# EAGLE design m202-stereo-input (EAGLE 7.6.0)
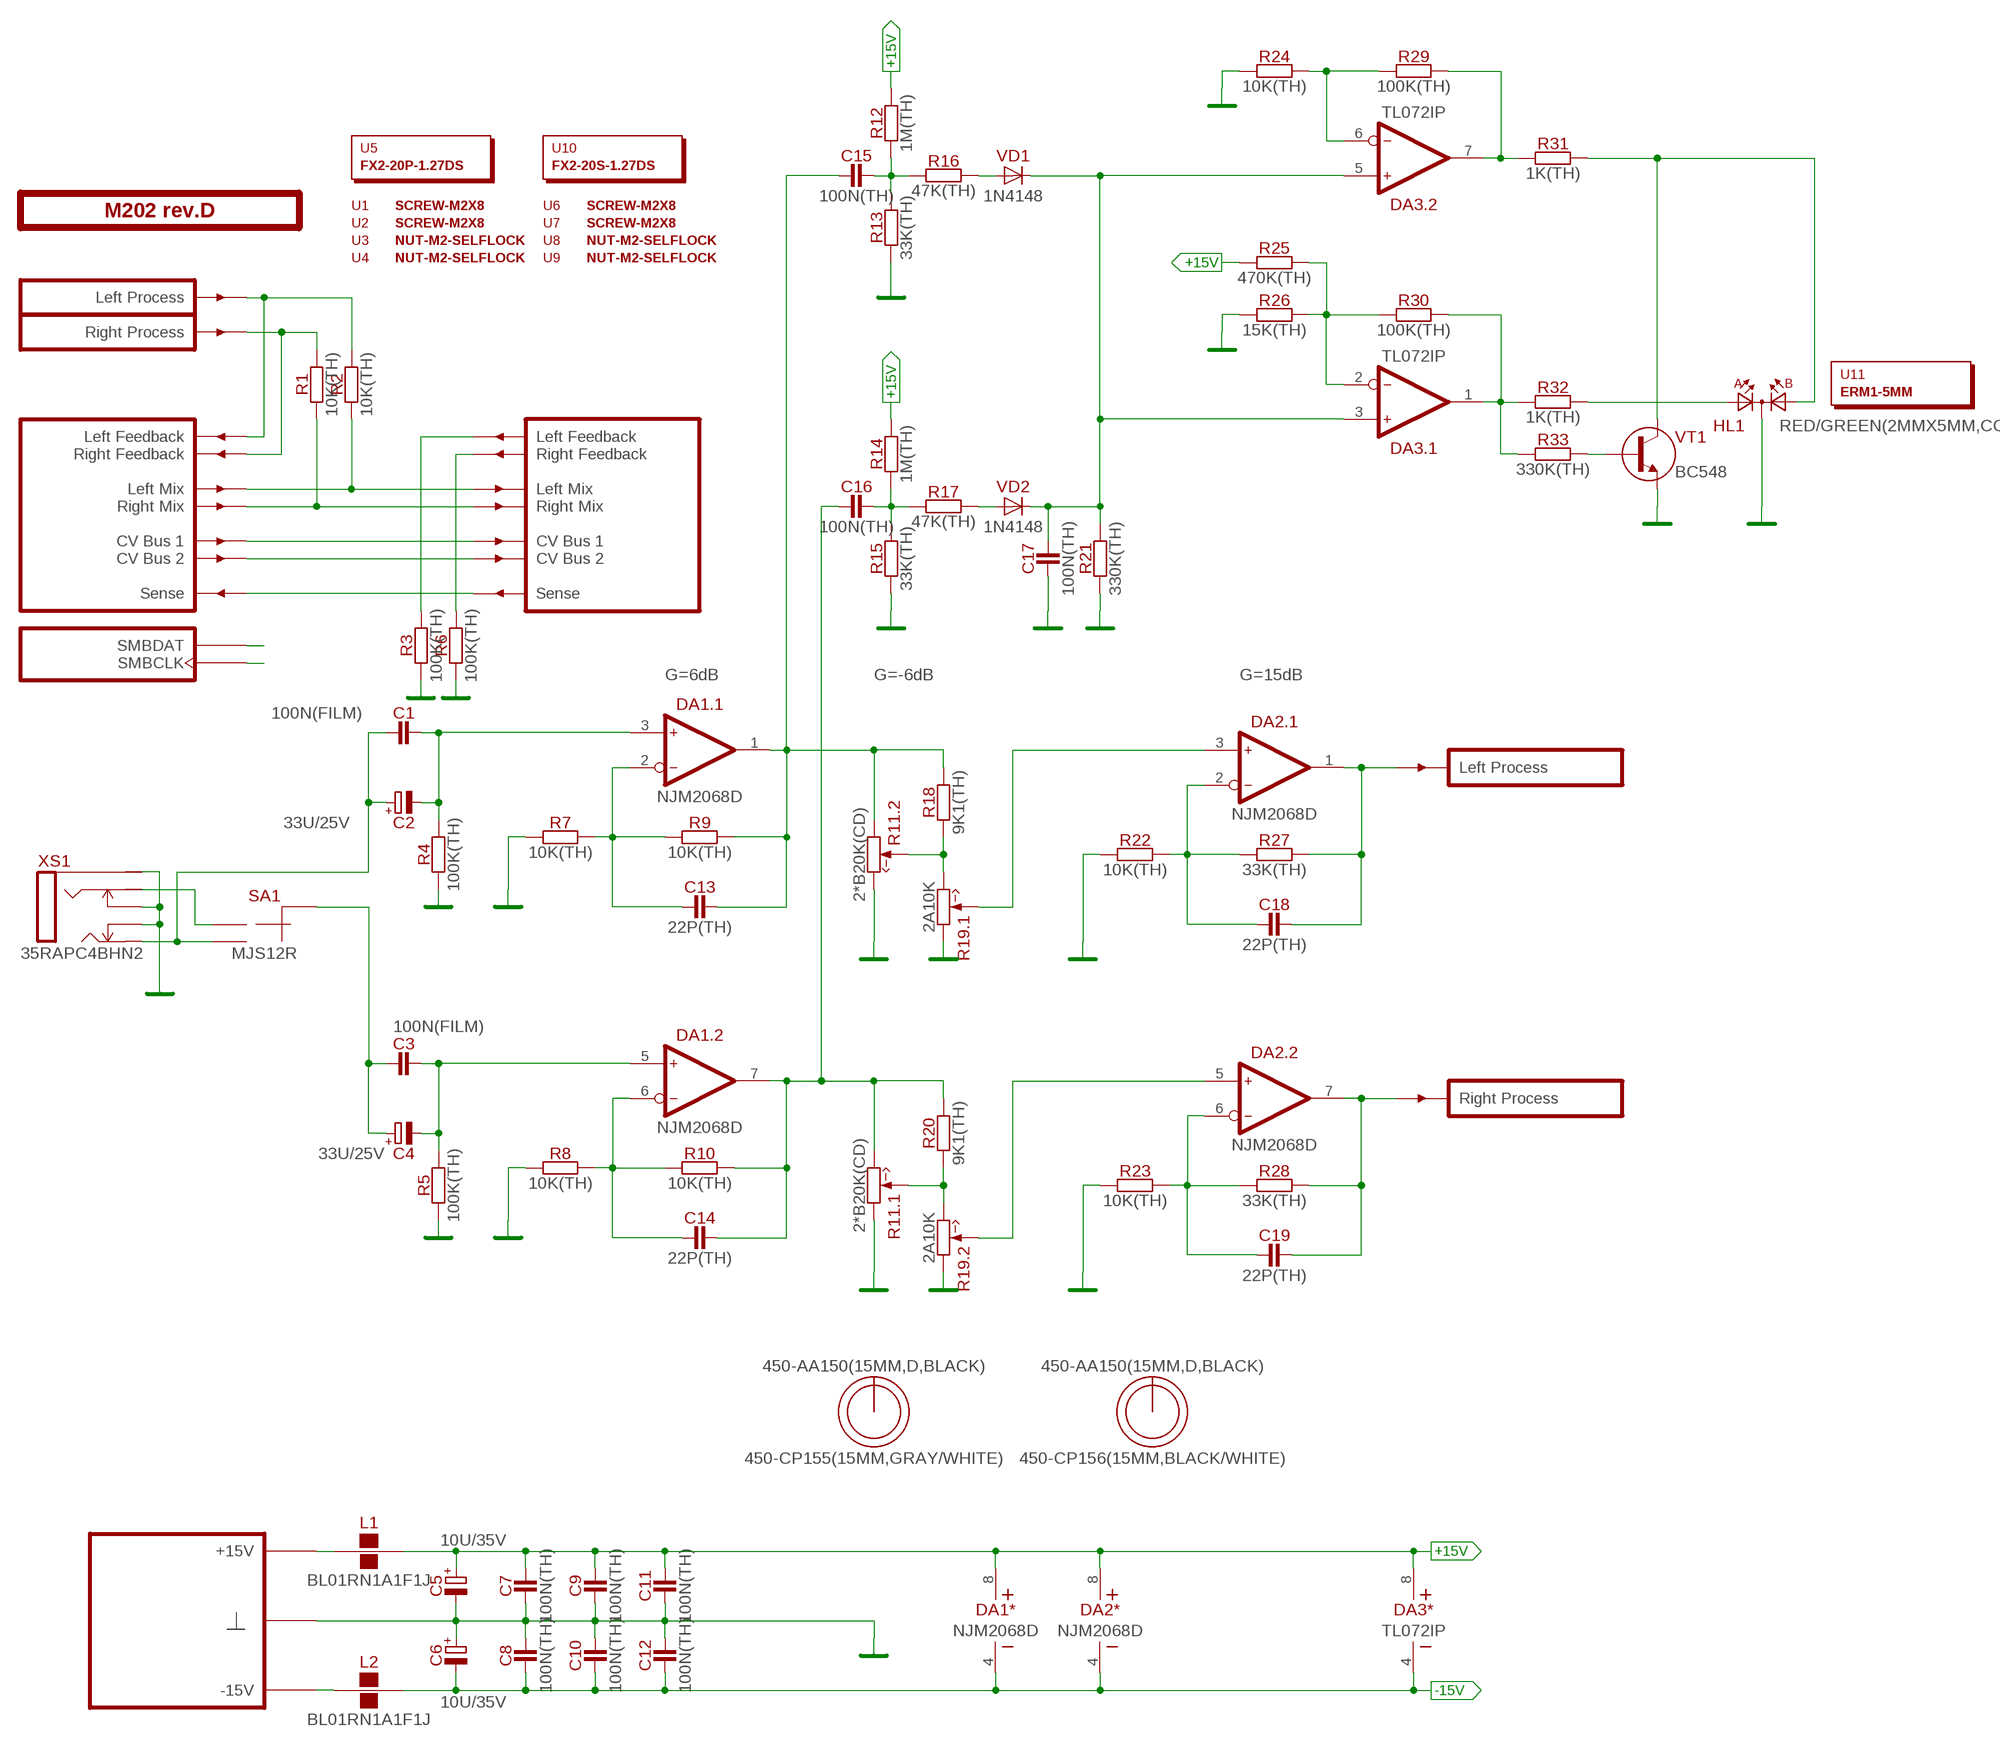
[diagram p0: schematic, sheet 1]

## Parts
C1  100N(FILM)  [C050-025X075]
C2  33U/25V  [E2,5-7]
C3  100N(FILM)  [C050-025X075]
C4  33U/25V  [E2,5-7]
C5  10U/35V  [E2-5]
C6  10U/35V  [E2-5]
C7  100N(TH)  [C050-024X044]
C8  100N(TH)  [C050-024X044]
C9  100N(TH)  [C050-024X044]
C10  100N(TH)  [C050-024X044]
C11  100N(TH)  [C050-024X044]
C12  100N(TH)  [C050-024X044]
C13  22P(TH)  [C050-024X044]
C14  22P(TH)  [C050-024X044]
C15  100N(TH)  [C050-024X044]
C16  100N(TH)  [C050-024X044]
C17  100N(TH)  [C050-024X044]
C18  22P(TH)  [C050-024X044]
C19  22P(TH)  [C050-024X044]
DA1  NJM2068D  [DIP-8]
DA2  NJM2068D  [DIP-8]
DA3  TL072IP  [DIP-8]
HL1  RED/GREEN(2MMX5MM,CC)  [LED2X5-3PIN]
L1  BL01RN1A1F1J  [BL01RN1A]
L2  BL01RN1A1F1J  [BL01RN1A]
O1  450-AA150(15MM,D,BLACK)  [EMPTY]
O2  450-CP155(15MM,GRAY/WHITE)  [EMPTY]
O3  450-AA150(15MM,D,BLACK)  [EMPTY]
O4  450-CP156(15MM,BLACK/WHITE)  [EMPTY]
PCB1  M202 rev.D  ST2-BOARD-50  [ST2-BOARD-50]
R1  10K(TH)  [R-0207/10]
R2  10K(TH)  [R-0207/10]
R3  100K(TH)  [R-0207/10]
R4  100K(TH)  [R-0207/10]
R5  100K(TH)  [R-0207/10]
R6  100K(TH)  [R-0207/10]
R7  10K(TH)  [R-0207/10]
R8  10K(TH)  [R-0207/10]
R9  10K(TH)  [R-0207/10]
R10  10K(TH)  [R-0207/10]
R11  2*B20K(CD)  2B20K(CD)  [RV11-DUAL]
R12  1M(TH)  [R-0207/10]
R13  33K(TH)  [R-0207/10]
R14  1M(TH)  [R-0207/10]
R15  33K(TH)  [R-0207/10]
R16  47K(TH)  [R-0207/10]
R17  47K(TH)  [R-0207/10]
R18  9K1(TH)  [R-0207/10]
R19  2A10K  [RV11-DUAL]
R20  9K1(TH)  [R-0207/10]
R21  330K(TH)  [R-0207/10]
R22  10K(TH)  [R-0207/10]
R23  10K(TH)  [R-0207/10]
R24  10K(TH)  [R-0207/10]
R25  470K(TH)  [R-0207/10]
R26  15K(TH)  [R-0207/10]
R27  33K(TH)  [R-0207/10]
R28  33K(TH)  [R-0207/10]
R29  100K(TH)  [R-0207/10]
R30  100K(TH)  [R-0207/10]
R31  1K(TH)  [R-0207/10]
R32  1K(TH)  [R-0207/10]
R33  330K(TH)  [R-0207/10]
SA1  MJS12R  [APEM-MJS12R]
U1  SCREW-M2X8  [EMPTY]
U2  SCREW-M2X8  [EMPTY]
U3  NUT-M2-SELFLOCK  [EMPTY]
U4  NUT-M2-SELFLOCK  [EMPTY]
U5  FX2-20P-1.27DS  [EMPTY]
U6  SCREW-M2X8  [EMPTY]
U7  SCREW-M2X8  [EMPTY]
U8  NUT-M2-SELFLOCK  [EMPTY]
U9  NUT-M2-SELFLOCK  [EMPTY]
U10  FX2-20S-1.27DS  [EMPTY]
U11  ERM1-5MM  [EMPTY]
VD1  1N4148  [DO35-7]
VD2  1N4148  [DO35-7]
VT1  BC548  [TO92]
XS1  35RAPC4BHN2  [35RAP]

## Nets
+15V [power]: C5.+ C7.2 C9.2 C11.2 DA1.8(*:V+) DA2.8(*:V+) DA3.8(*:V+) L1.2 R12.2 R14.2 R25.1
-15V: C6.- C8.1 C10.1 C12.1 DA1.4(*:V-) DA2.4(*:V-) DA3.4(*:V-) L2.2
GND: C5.- C6.+ C7.1 C8.2 C9.1 C10.2 C11.1 C12.2 C17.1 HL1.K PCB1.B4'(GND) PCB1.B4(GND) PCB1.B5'(GND) PCB1.B5(GND) PCB1.B6'(GND) PCB1.B6(GND) PCB1.B7'(GND) PCB1.B7(GND) PCB1.B8'(GND) PCB1.B8(GND) R3.1 R4.1 R5.1 R6.1 R7.1 R8.1 R11.1(.1:CCW) R11.3'(.2:CW) R13.1 R15.1 R19.1'(.2:CCW) R19.1(.1:CCW) R21.1 R22.1 R23.1 R24.1 R26.1 VT1.3(E) XS1.1(S) XS1.10(TN) XS1.11(RN)
LMIX: PCB1.ALMIX'(LMIX') PCB1.ALMIX(LMIX) R2.1
N$1: L1.1 PCB1.A+15'(P+15V) PCB1.A+15(P+15V) PCB1.B+15'(P+15V) PCB1.B+15(P+15V)
N$2: PCB1.ARFBK'(RFBK') R6.2
N$3: DA2.3(.1:IN+) R19.2(.1:W)
N$4: PCB1.ALFBK'(LFBK') R3.2
N$5: L2.1 PCB1.A-15'(P-15V) PCB1.A-15(P-15V) PCB1.B-15'(P-15V) PCB1.B-15(P-15V)
N$6: SA1.NC XS1.3(R)
N$7: C1.1 C2.+ SA1.NO XS1.2(T)
N$8: DA2.5(.2:IN+) R19.2'(.2:W)
N$9: C3.2 C4.- DA1.5(.2:IN+) R5.2
N$10: C1.2 C2.- DA1.3(.1:IN+) R4.2
N$11: C19.2 DA2.7(.2:OUT) PCB1.BOUTR'(OUTR) R28.2
N$12: C18.2 DA2.1(.1:OUT) PCB1.BOUTL'(OUTL) R27.2
N$13: C18.1 DA2.2(.1:IN-) R22.2 R27.1
N$14: C19.1 DA2.6(.2:IN-) R23.2 R28.1
N$15: C14.2 C16.1 DA1.7(.2:OUT) R10.2 R11.3(.1:CW) R20.2
N$16: PCB1.BSENSE'(SENSE') PCB1.BSENSE(SENSE)
N$17: C15.2 R12.1 R13.2 R16.1
N$18: DA3.6(.2:IN-) R24.2 R29.1
N$19: C13.2 C15.1 DA1.1(.1:OUT) R9.2 R11.1'(.2:CCW) R18.2
N$20: DA3.7(.2:OUT) R29.2 R31.1
N$21: HL1.A2 R31.2 VT1.1(C)
N$22: DA3.2(.1:IN-) R25.2 R26.2 R30.1
N$23: DA3.1(.1:OUT) R30.2 R32.1 R33.1
N$25: R33.2 VT1.2(B)
N$26: C13.1 DA1.2(.1:IN-) R7.2 R9.1
N$27: C14.1 DA1.6(.2:IN-) R8.2 R10.1
N$29: R16.2 VD1.A
N$30: R11.2'(.2:W) R18.1 R19.3(.1:CW)
N$31: C16.2 R14.1 R15.2 R17.1
N$32: R11.2(.1:W) R19.3'(.2:CW) R20.1
N$33: HL1.A1 R32.2
N$36: C3.1 C4.+ SA1.C(CM)
N$38: PCB1.ASMBDAT'(SMBDAT) PCB1.ASMBDAT(SMBDAT)
N$39: PCB1.ARFBK(RFBK) PCB1.BINR(INR) R1.2
N$40: PCB1.ALFBK(LFBK) PCB1.BINL(INL) R2.2
N$41: PCB1.ACV1'(CV1') PCB1.ACV1(CV1)
N$42: PCB1.ACV2'(CV2') PCB1.ACV2(CV2)
N$43: PCB1.ASMBCLK'(SMBCLK) PCB1.ASMBCLK(SMBCLK)
N$44: R17.2 VD2.A
N$45: C17.2 DA3.3(.1:IN+) DA3.5(.2:IN+) R21.2 VD1.C VD2.C
RMIX: PCB1.ARMIX'(RMIX') PCB1.ARMIX(RMIX) R1.1

## Notes on the sheet
- G=6dB | G=-6dB | G=15dB

## Library data of the parts
C1 C3 = capacitors:?; MOUSER: 505-MKS2.1/63/5
C2 C4 = capacitors-electrolytic:?
C5 C6 = capacitors-electrolytic:?; MOUSER: 647-USW1V100MDD
C7-C12 C15-C17 = capacitors:?; MOUSER: 81-RCER71H104K0A2H3B
C13 C14 C18 C19 = capacitors:?
DA1 DA2 = ic-jrc:NJM2068; MOUSER: 513-NJM2068D
DA3 = ic-ti:TL072; MOUSER: 595-TL072IP
HL1 = optoelectronics:?(2MMX5MM,CC)
L1 L2 = inductors:BL01RN1A?; MOUSER: 81-BL01RN1A1F1J
O1 O3 = hardware:450-AA?; MOUSER: 450-AA150
O2 = hardware:450-C?; MOUSER: 450-CP155
O4 = hardware:450-C?; MOUSER: 450-CP156
PCB1 = module-footprints:ST2-BOARD-?
R1 R2 R7-R10 R22-R24 = resistors:?; MOUSER: 71-RN55D-F-10K
R3-R6 R29 R30 = resistors:?; MOUSER: 71-RN55D-F-100K
R11 = potentiometers:2**?; MOUSER: 688-RK12L1230C1M
R12-R18 R20 R21 R25-R28 R33 = resistors:?
R19 = potentiometers:2**?; MOUSER: 688-RK12L12C0A0E
R31 R32 = resistors:?; MOUSER: 71-RN55D-F-1.0K
SA1 = switches:MJS12R; MOUSER: 642-MJS12R
U1-U4 U6-U9 = hardware:*?
U5 = hardware:?; MOUSER: 798-FX2-20P-1.27DS71
U10 = hardware:?; MOUSER: 798-FX2-20S-1.27DS71
U11 = hardware:?
VD1 VD2 = diodes:?; MOUSER: 583-1N4148-T
VT1 = transistors-npn:?
XS1 = connectors:35RAPC4BHN2; MOUSER: 502-35RAPC4BHN2

## Board
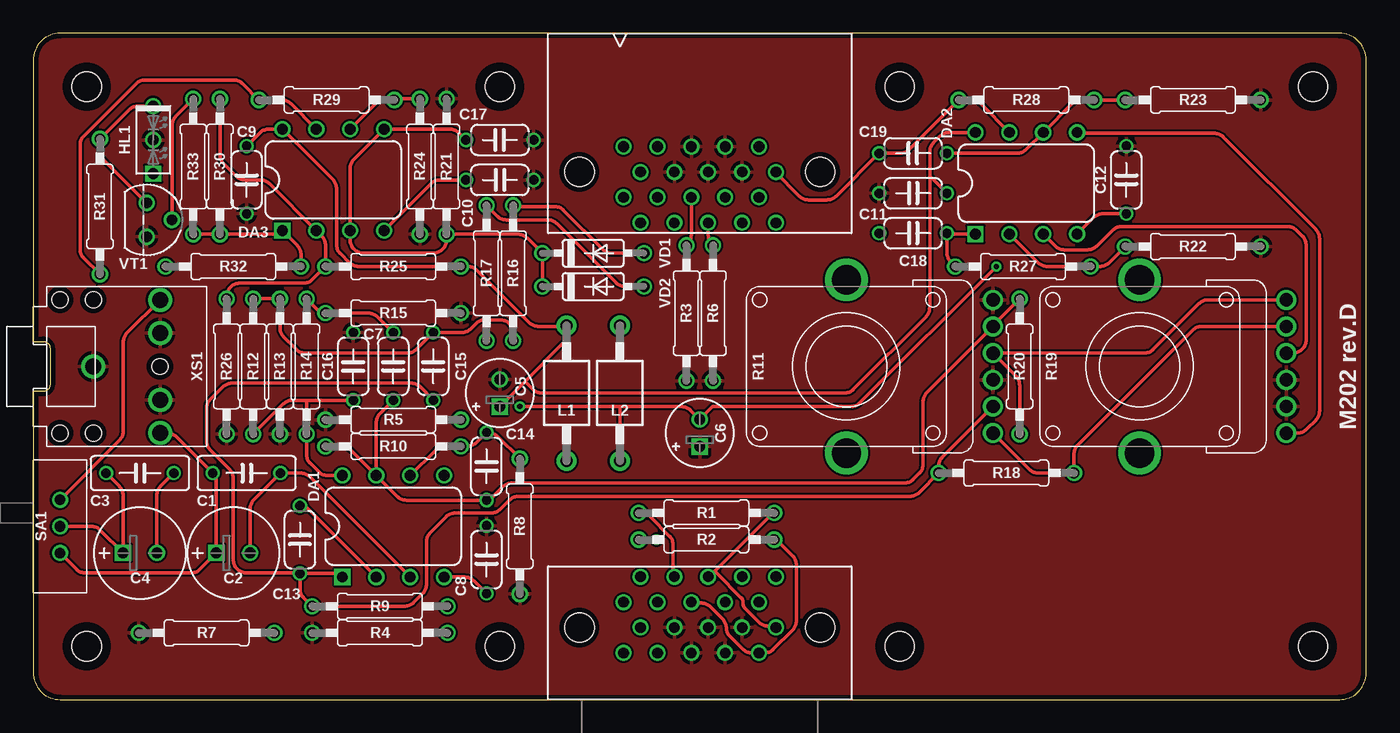
[diagram p1: board, top side]
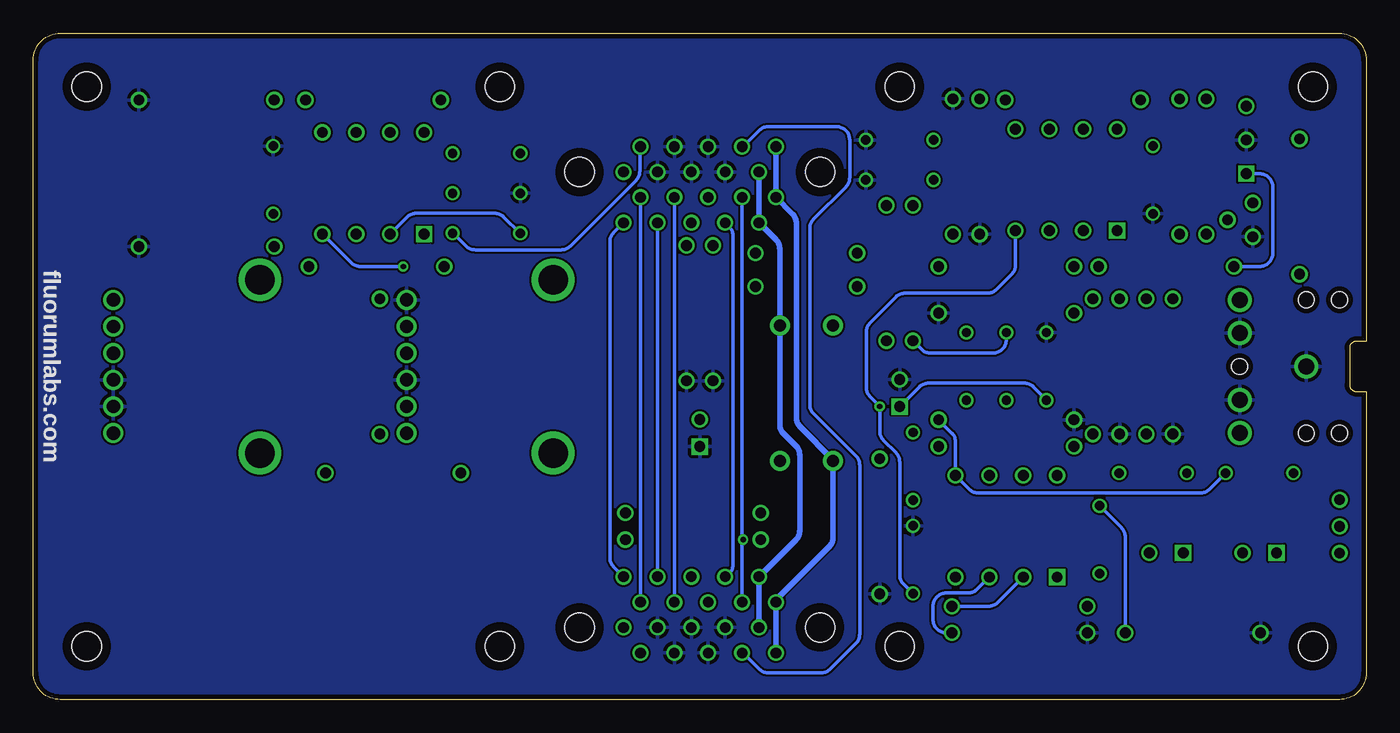
[diagram p2: board, bottom side, seen from below]

Size 100 x 50 mm. Coordinates in mm from the lower left corner, seen from the top.
Outline: 0,48 0,26.88 0.75,26.88 arc-90 1.25,26.38 1.25,23.62 arc-90 0.75,23.12 0,23.12 0,2 arc90 2,0 98,0 arc90 100,2 100,48 arc90 98,50 2,50 arc90 0,48
Copper layers (1*16): Top 0.0356mm / dielectric 1.5011mm / Bottom 0.0356mm
Design rules "LaenPCBOrder": minimum track width 6mil, minimum drill 13mil, track to track 6mil, track to pad 6mil, pad to pad 6mil, via to via 6mil, smd to smd 6mil, copper to edge 15mil, drill to drill 6mil, minimum pad ring 7mil, minimum via ring 7mil, stop-mask expansion 3mil, vias tented up to drill 0mil, thermal gap 10mil

### Footprints (pad centres in the part's own frame; a part is rotated, then mirrored left to right if it is on the bottom)
C050-025X075 = drill 0.7: 1 -2.54,0; 2 2.54,0
E2,5-7 = drill 0.813 square: + -1.27,0 | drill 0.813: - 1.27,0
E2-5 = drill 0.813 square: + -1.016,0 | drill 0.813: - 1.016,0
C050-024X044 = drill 0.7: 1 -2.54,0; 2 2.54,0
DIP-8 = drill 0.813 square: 1 -3.81,-3.81 | drill 0.813: 2 -1.27,-3.81; 3 1.27,-3.81; 4 3.81,-3.81; 5 3.81,3.81; 6 1.27,3.81; 7 -1.27,3.81; 8 -3.81,3.81
LED2X5-3PIN = drill 0.813 square: A1 -2.54,0 | drill 0.813: A2 2.54,0; K 0,0
BL01RN1A = drill 0.9 pad 1.5: 1 -5.08,0; 2 5.08,0
ST2-BOARD-50 = drill 0.8: A+15 44.285,7.31; A+15' 44.285,37.69; A-15 45.555,9.215; A-15' 45.555,35.785; ACV1 51.905,7.31; ACV1' 51.905,37.69; ACV2 53.175,9.215; ACV2' 53.175,35.785; ALFBK 49.365,7.31; ALFBK' 49.365,37.69; ALMIX 46.825,7.31; ALMIX' 46.825,37.69; ARFBK 50.635,9.215; ARFBK' 50.635,35.785; ARMIX 48.095,9.215; ARMIX' 48.095,35.785; ASMBCLK 55.715,9.215; ASMBCLK' 55.715,35.785; ASMBDAT 54.445,7.31; ASMBDAT' 54.445,37.69; B4 48.095,5.405; B4' 48.095,39.595; B5 49.365,3.5; B5' 49.365,41.5; B6 50.635,5.405; B6' 50.635,39.595; B7 51.905,3.5; B7' 51.905,41.5; B8 53.175,5.405; B8' 53.175,39.595; B+15 44.285,3.5; B+15' 44.285,41.5; B-15 45.555,5.405; B-15' 45.555,39.595; BINL 54.445,3.5; BINR 55.715,5.405; BOUTL' 54.445,41.5; BOUTR' 55.715,39.595; BSENSE 46.825,3.5; BSENSE' 46.825,41.5 | hole 2.2: 4,4; 4,46; 96,4; 96,46; 35,46; 65,46; 65,4; 35,4; 59.025,5.405; 40.975,5.405; 40.975,39.595; 59.025,39.595
R-0207/10 = drill 0.813: 1 -5.08,0; 2 5.08,0
RV11-DUAL = drill 1: 1 -1,-11; 1' -3,-11; 2 1,-11; 2' -5,-11; 3 3,-11; 3' 5,-11 | drill 2.2: S1 -6.5,0; S2 6.5,0
APEM-MJS12R = drill 0.8: C 0,-2; NC 2,-2; NO -2,-2
DO35-7 = drill 0.813: A 3.81,0; C -3.81,0
TO92 = drill 0.813: 1 -1.27,0; 2 0,1.905; 3 1.27,0
35RAP = drill 1.2: 1 4.5,0; 2 9.5,-5; 3 9.5,5; 10 9.5,-2.5; 11 9.5,2.5 | hole 1.2: 2,5; 2,-5; 4.5,5; 4.5,-5; 9.5,0

### Placement (x,y rotation side)
C1  16,17 0 top
C2  15,11 0 top
C3  8,17 0 top
C4  8,11 0 top
C5  35,23 90 top
C6  50,20 90 top
C7  24,25 270 top
C8  34,10.5 90 top
C9  16,39 90 top
C10  35,39 0 top
C11  66,38 0 top
C12  82,39 90 top
C13  20,12 270 top
C14  34,17.5 270 top
C15  30,25 90 top
C16  27,25 90 top
C17  35,42 180 top
C18  66,35 0 top
C19  66,41 180 top
DA1  27,13 0 top
DA2  74.5,38.75 0 top
DA3  22.5,39 0 top
HL1  9,42 90 top
L1  40,23 90 top
L2  44,23 270 top
O1  74.5,-100.5 0 top  (outside the outline)
O2  76.75,-100.5 0 top  (outside the outline)
O3  79,-100.5 0 top  (outside the outline)
O4  81.25,-100.5 0 top  (outside the outline)
PCB1  0,0 0 top
R1  50.5,14 0 top
R2  50.5,12 0 top
R3  49,29 90 top
R4  26,5 0 top
R5  27,21 0 top
R6  51,29 90 top
R7  13,5 0 top
R8  36.5,13 90 top
R9  26,7 180 top
R10  27,19 180 top
R11  61,25 90 top
R12  16.5,25 270 top
R13  18.5,25 90 top
R14  20.5,25 270 top
R15  27,29 180 top
R16  36,32 90 top
R17  34,32 90 top
R18  73,17 180 top
R19  2*A10K  [RV11-DUAL]  83,25 90 top
R20  74,25 90 top
R21  31,40 270 top
R22  87,34 180 top
R23  87,45 180 top
R24  29,40 90 top
R25  27,32.5 180 top
R26  14.5,25 90 top
R27  74.25,32.5 180 top
R28  74.5,45 180 top
R29  22,45 180 top
R30  14,40 270 top
R31  5,37 90 top
R32  15,32.5 180 top
R33  12,40 90 top
SA1  0,13 90 top
U1  90.25,-100.5 0 top  (outside the outline)
U2  92.5,-100.5 0 top  (outside the outline)
U3  94.75,-100.5 0 top  (outside the outline)
U4  1,-102.75 0 top  (outside the outline)
U5  83.5,-100.5 0 top  (outside the outline)
U6  3.25,-102.75 0 top  (outside the outline)
U7  5.5,-102.75 0 top  (outside the outline)
U8  7.75,-102.75 0 top  (outside the outline)
U9  10,-102.75 0 top  (outside the outline)
U10  85.75,-100.5 0 top  (outside the outline)
U11  7,-138 0 top  (outside the outline)
VD1  42,33.5 0 top
VD2  42,31 0 top
VT1  8.5,36 270 top
XS1  0,25 0 top

### Tracks (layer width: path | path; a pad name or v marks a point on that pad's centre or on a via)
+15V
  Top 0.254: DA1.8 22.1,16.81 arc-45 21.4,17.1 20.79,17.71 arc-45 20.5,18.41 R14.2 20.5,22.46 | C7.2 20.5,22.46 | 20.5,22.46 19.45,22.46 arc45 18.75,22.17 R12.2 | DA2.8 68.72,42.56 arc45 68.02,42.27 67.54,41.79 arc45 67.25,41.09 67.25,39.29 | 67.25,39.29 C11.2 | C5.+ 35,22 36.88,23.88 | 36.88,23.88 39.71,26.71 arc45 40,27.41 L1.2 39.92,28 37.91,28 arc-45 37.21,28.29 33.29,32.21 arc45 32.59,32.5 R25.1 24.41,32.5 arc-45 23.71,32.79 23.04,33.46 arc-45 22.75,34.16 22.75,38.34 arc45 22.46,39.04 DA3.8 17.68,42.81 arc45 16.98,42.52 C9.2 | 67.25,39.29 67.25,29.41 arc-45 66.96,28.71 61.54,23.29 arc-45 60.84,23 38.16,23 arc-45 37.46,23.29 36.88,23.88
  Bottom 0.254: C7.2 24,22.5 24.96,23.46 arc-45 25.66,23.75 32.82,23.75 arc-45 33.53,23.46 C5.+
-15V  (via drill 0.4)
  Top 0.254: DA1.4 32.36,9.19 arc-45 33.06,8.9 C8.1 | C12.1 80.24,36.46 arc45 79.54,36.17 DA2.4 | v72.25,32.5 62.03,22.28 arc-45 61.32,21.98 50.97,21.98 C6.- 49.33,21.69 arc45 48.62,21.98 44,21.98 | v36.5,22 36.52,21.98 44,21.98 | L2.2 44,21.98 | C10.1 30.53,39 arc45 29.83,38.71 DA3.4
  Bottom 0.254: v72.25,32.5 75.46,32.5 arc45 76.16,32.79 DA2.4 | C8.1 34.71,8.67 arc45 35,9.37 35,17.84 arc-45 35.29,18.54 36.21,19.46 arc45 36.5,20.16 v36.5,22 37.21,22.71 arc45 37.5,23.41 37.5,27.59 arc45 37.21,28.29 35.29,30.21 arc45 34.59,30.5 28.41,30.5 arc-45 27.71,30.79 26.6,31.9 arc-45 26.31,32.6 DA3.4
GND
  pour Bottom: 0,50 100,50 100,0 0,0
  pour Top: 0,50 100,50 100,0 0,0
LMIX  (via drill 0.4)
  Top 0.254: v46.75,12 R2.1
  Bottom 0.254: PCB1.ALMIX 46.83,12 | 46.83,12 PCB1.ALMIX' | v46.75,12 46.83,12
N$1
  Bottom 0.406: PCB1.B+15 PCB1.A+15 44.28,7.46 40.29,11.46 arc-45 40,12.16 L1.1 40,18 42.46,20.46 arc45 42.75,21.16 42.75,35.74 arc-45 43.04,36.45 PCB1.A+15' | 44.25,37.66 PCB1.A+15' | PCB1.B+15' PCB1.A+15'
N$2
  Top 0.254: PCB1.ARFBK' 50.63,34.86 arc45 50.93,34.15 R6.2
N$3
  Top 0.254: R19.2 94.5,26 arc90 95.5,27 95.5,34.09 arc45 95.21,34.79 94.79,35.21 arc45 94.09,35.5 81.66,35.5 arc45 80.96,35.21 79.79,34.04 arc-45 79.09,33.75 77.37,33.75 arc-45 76.67,34.04 DA2.3
N$4
  Top 0.254: PCB1.ALFBK' 49.37,34.86 arc-45 49.07,34.15 R3.2
N$5
  Bottom 0.406: PCB1.B-15' PCB1.A-15' 44.29,34.52 arc45 44,33.82 L2.1 44,20.66 arc-45 43.71,19.96 42.79,19.04 arc45 42.5,18.34 42.5,12.68 arc45 42.79,11.98 PCB1.A-15 PCB1.B-15
N$6
  Top 0.254: SA1.NC 6.46,19.46 arc45 6.75,20.16 6.75,26.84 arc-45 7.04,27.54 XS1.3
N$7
  Top 0.254: XS1.2 10.05,20 arc-45 10.75,19.71 C1.1 arc-45 13.73,16.35 C2.+ 12.52,9.79 arc-45 11.82,9.5 3.91,9.5 arc-45 3.21,9.79 SA1.NO
N$8
  Top 0.254: R19.2' 94.84,20 arc45 95.54,20.29 96.21,20.96 arc45 96.5,21.66 96.5,34.59 arc45 96.21,35.29 89.29,42.21 arc45 88.59,42.5 78.37,42.5 DA2.5
N$9
  Top 0.254: C4.- 9.27,15.32 arc-45 9.56,16.02 C3.2
  Bottom 0.254: R5.2 31.1,20.02 arc45 30.81,19.32 DA1.5 29.79,15.79 arc-45 29.09,15.5 12.45,15.5 arc-45 11.75,15.79 C3.2
N$10
  Top 0.254: C2.- 16.27,14.32 arc-45 16.56,15.02 C1.2 20.05,17 arc-45 20.75,16.71 DA1.3
  Bottom 0.254: R4.2 31.5,5 arc90 32.5,6 32.5,7 arc90 31.5,8 29.87,8 arc-45 29.17,8.29 DA1.3
N$11
  Top 0.254: DA2.7 71.08,44.71 arc45 70.38,45 R28.2 65.71,41.29 arc-45 65.01,41 C19.2 60.25,37.79 arc-45 59.55,37.5 58.16,37.5 arc-45 57.46,37.79 55.72,39.53 PCB1.BOUTR'
N$12
  Top 0.254: DA2.1 68.6,34.94 C18.2 68.54,33.54 arc45 68.83,32.84 R27.2
  Bottom 0.254: C18.2 68.5,35 67.54,34.04 arc-45 66.84,33.75 60.41,33.75 arc-45 59.71,34.04 54.79,38.96 arc-45 54.5,39.66 54.5,41.45 PCB1.BOUTL'
N$13
  Top 0.254: DA2.2 75.38,32.79 arc45 76.08,32.5 R27.1 80.01,32.5 arc45 80.71,32.79 R22.2
  Bottom 0.254: C18.1 63.5,35 64.71,36.21 arc-45 65.41,36.5 71.26,36.5 arc-45 71.96,36.21 DA2.2
N$14
  Top 0.254: C19.1 73.8,41 arc45 74.5,41.29 DA2.6 77.92,44.71 arc-45 78.62,45 R28.1 R23.2
N$15
  Top 0.254: R10.2 23.13,19 arc-45 23.83,18.71 DA1.7 | DA1.7 27.29,15.25 arc45 27.99,14.96 C14.2 34.21,14.96 35.21,15.96 arc-45 35.91,16.25 65.34,16.25 arc45 66.04,16.54 66.46,16.96 arc45 66.75,17.66 66.75,22.34 arc-45 67.04,23.04 R11.3 72,28.08 R20.2 | DA1.7 25.73,20.78 arc-45 26.02,21.48 C16.1
N$16
  Bottom 0.254: PCB1.BSENSE 46.75,3.5 45.54,2.29 arc-45 44.84,2 40.91,2 arc-45 40.21,2.29 38.29,4.21 arc-45 38,4.91 38,17.59 arc-45 38.29,18.29 41.46,21.46 arc45 41.75,22.16 41.75,35.34 arc45 41.46,36.04 39.04,38.46 arc-45 38.75,39.16 38.75,42 arc-90 39.75,43 44.84,43 arc-45 45.54,42.71 46.75,41.5 PCB1.BSENSE'
N$17
  Top 0.254: R12.1 R13.2 18.5,27.91 arc45 18.79,27.21 19.71,26.29 arc45 20.41,26 28.05,26 arc45 28.75,26.29 C15.2 32.13,27.54 arc45 32.83,27.83 33.21,28.21 arc-45 33.91,28.5 35,28.5 arc-90 36,27.5 R16.1
N$18
  Top 0.254: DA3.6 25.67,44.71 arc-45 26.37,45 R29.1 27.16,45.08 R24.2
N$19
  Top 0.254: C13.2 22.92,9.46 DA1.1 | R11.1' 68.21,18.21 arc45 67.92,17.51 R18.2 66.46,15.54 arc-45 65.76,15.25 36.41,15.25 arc45 35.71,14.96 35.04,14.29 arc-45 34.34,14 31.66,14 arc45 30.96,13.71 29.79,12.54 arc45 29.5,11.84 29.5,8.66 arc-45 29.21,7.96 28.54,7.29 arc-45 27.84,7 R9.2 20.29,7.63 arc-45 20,8.33 C13.2 | C15.1 30,22.5 29.04,23.46 arc45 28.34,23.75 14.91,23.75 arc45 14.21,23.46 13.29,22.54 arc45 13,21.84 13,19.41 arc45 13.29,18.71 14.71,17.29 arc-45 15,16.59 15,10.5 arc90 16,9.5 19.96,9.5 C13.2
N$20
  Top 0.254: DA3.7 19.33,44.71 arc45 18.63,45 R29.2 15.71,46.21 arc45 15.01,46.5 8.41,46.5 arc45 7.71,46.21 3.79,42.29 arc45 3.5,41.59 3.5,33.83 arc45 3.79,33.13 R31.1
N$21
  Top 0.254: HL1.A2 7.87,44.54 arc45 7.17,44.25 R31.2 5,41.18 arc45 5.29,40.48 VT1.1
N$22
  Top 0.254: R30.1 14,40.91 arc45 14.29,40.21 15.21,39.29 arc45 15.91,39 17.01,39 arc-45 17.71,38.71 DA3.2 21.63,34.79 arc-45 21.92,34.09 R25.2 20.96,31.54 arc-45 20.26,31.25 15.5,31.25 arc90 14.5,30.25 R26.2
N$23
  Top 0.254: R33.1 R30.2 18.04,34.92 arc45 DA3.1 19.79,34.09 arc-45 20.08,33.39 R32.1
N$25
  Top 0.254: VT1.2 10.4,43.07 arc-45 10.7,43.78 R33.2
N$26
  Top 0.254: C13.1 arc-45 20.65,14.27 DA1.2
  Bottom 0.254: R9.1 28.33,7 arc-45 27.63,7.29 DA1.2 | R7.2 18.08,12.21 arc-45 18.37,12.91 C13.1
N$27
  Top 0.254: DA1.6 30.17,18.71 arc-45 30.87,19 R10.1 32.55,19 arc45 33.25,19.29 C14.1 34.13,20.04 arc-45 34.83,19.75 R8.2
N$29
  Top 0.254: VD1.A 43.41,33.5 arc-45 42.71,33.79 39.79,36.71 arc45 39.09,37 36.08,37 R16.2
N$30
  Top 0.254: R11.2' 74.71,17.29 arc45 75.41,17 R18.1 78.08,18.42 arc-45 78.37,19.12 86.96,27.71 arc-45 87.66,28 R19.3
N$31
  Top 0.254: R14.1 21.34,29.24 arc45 R15.2 25.13,29 arc-45 25.83,28.71 C16.2
  Bottom 0.254: C16.2 27,27 arc90 28,26 32.67,26 arc45 33.37,26.29 R17.1
N$32
  Top 0.254: R20.1 74,23.59 arc45 73.71,24.29 R11.2 83.34,26 arc45 84.04,26.29 87.46,29.71 arc-45 88.16,30 R19.3'
N$33
  Bottom 0.254: HL1.A1 8,39.46 arc90 7,38.46 7,33.5 arc90 8,32.5 R32.2
N$36
  Top 0.254: C3.1 6.44,16.02 arc-45 6.73,15.32 C4.+ 5.02,12.71 arc45 4.32,13 SA1.C
N$38
  Bottom 0.254: PCB1.ASMBDAT PCB1.ASMBDAT'
N$39
  Top 0.254: 51,9.5 55.5,14 R1.2 | 51,9.5 50.75,9.25 PCB1.ARFBK 51,9.5 | PCB1.BINR 55.5,5.5 55.16,5.5 arc-45 54.46,5.79 53.4,6.85 arc-45 53.25,7.21 53.25,7.29 arc45 53.1,7.65 51.25,9.5 51,9.5
N$40
  Top 0.254: R2.2 55.75,12 56.96,10.79 arc-45 57.25,10.09 57.25,5.91 arc-45 56.96,5.21 55.54,3.79 arc-45 54.84,3.5 PCB1.BINL 53.91,3.5 arc-45 53.21,3.79 52.24,4.76 arc-45 52,5.34 arc45 51.71,6.04 50.79,6.96 arc45 50.09,7.25 49.5,7.25 PCB1.ALFBK
N$41
  Bottom 0.254: PCB1.ACV1 PCB1.ACV1'
N$42
  Bottom 0.254: PCB1.ACV2 PCB1.ACV2'
N$43
  Bottom 0.254: PCB1.ASMBCLK 56.46,9.96 arc45 56.75,10.66 56.75,34.34 arc45 56.46,35.04 PCB1.ASMBCLK'
N$44
  Top 0.254: VD2.A 44.41,31 arc-45 43.71,31.29 39.29,35.71 arc45 38.59,36 35.49,36 arc-45 34.79,36.29 R17.2
N$45
  Top 0.254: VD2.C VD1.C 37.06,34.63 arc45 36.36,34.92 R21.2 31,34.5 arc-90 30,33.5 24.77,33.5 arc-90 23.77,34.5 DA3.3 23.77,39.86 arc-45 24.06,40.56 DA3.5 31.24,42.81 arc-45 31.94,42.52 C17.2
RMIX
  Top 0.254: R1.1 45.59,14 arc-45 46.29,13.71 47.71,12.29 arc-45 48,11.59 48,9.25 PCB1.ARMIX
  Bottom 0.254: PCB1.ARMIX 48.03,9.21 47.79,9.46 arc-45 47.5,10.16 47.5,34.78 arc-45 47.79,35.48 PCB1.ARMIX'